# EAGLE schematic proto (EAGLE 5.10)
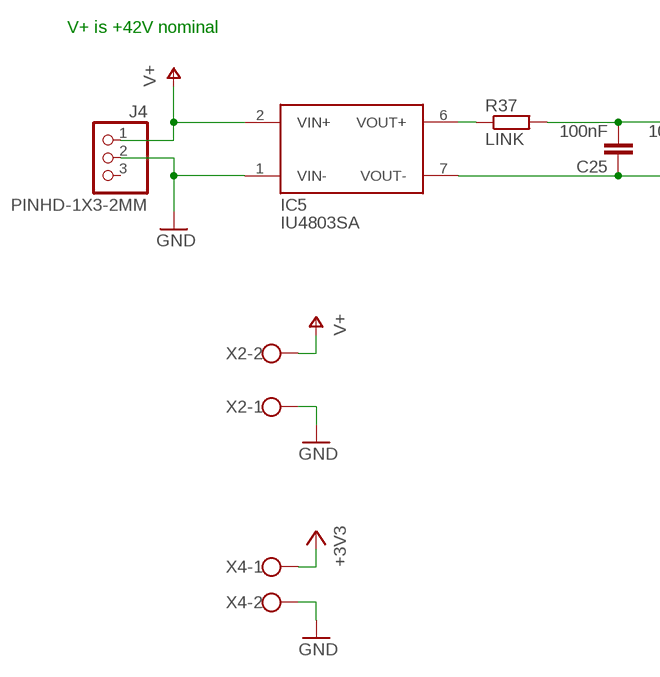
[diagram p0: schematic, sheet 1, part 1 of 2]
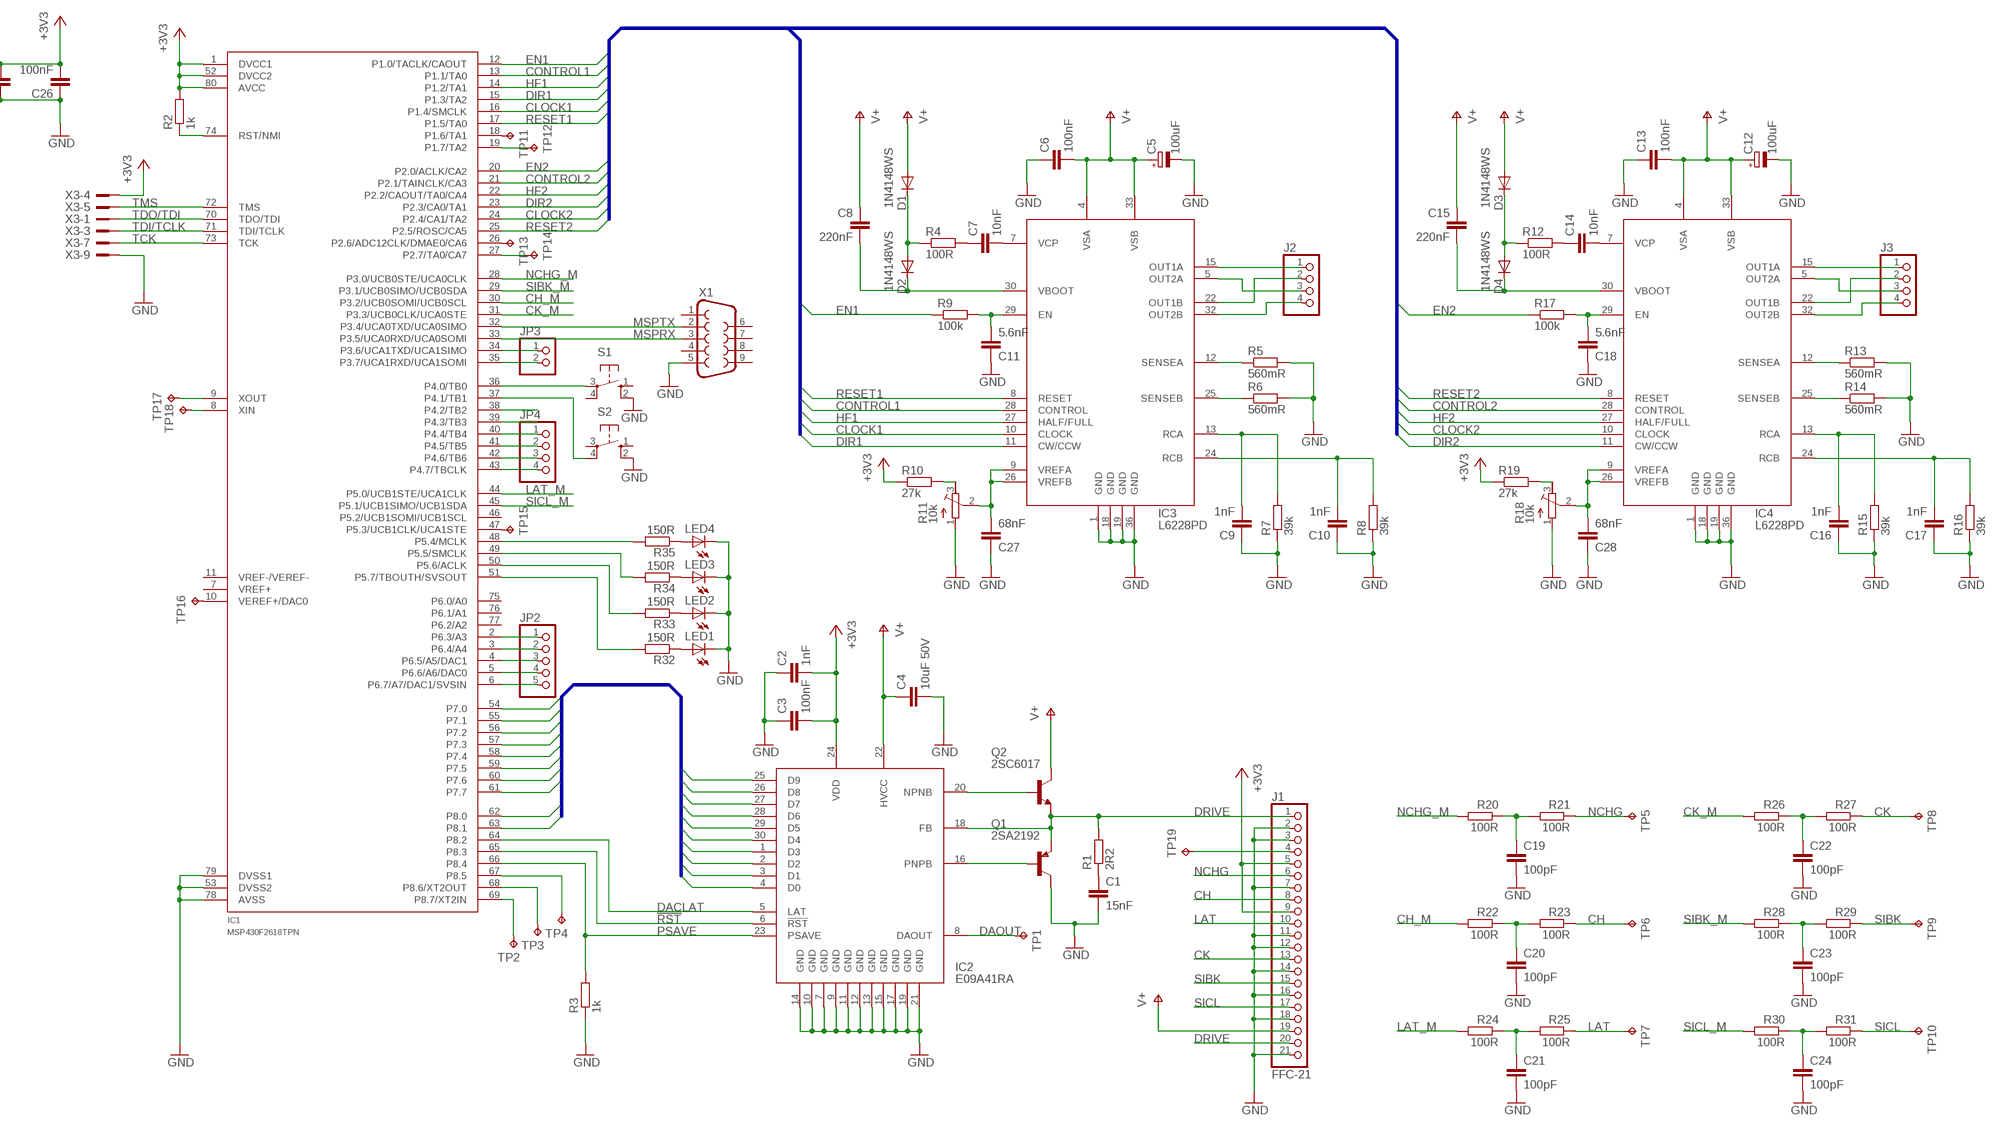
[diagram p1: schematic, sheet 1, part 2 of 2]

## Parts
C1  15nF  C-EUC0603  [C0603]
C2  1nF  C-EUC0603  [C0603]
C3  100nF  C-EUC0603  [C0603]
C4  10uF 50V  C-EUC1210  [C1210]
C5  100uF  CPOL-EUE3.5-8  [E3,5-8]
C6  100nF  C-EUC0805  [C0805]
C7  10nF  C-EUC0603  [C0603]
C8  220nF  C-EUC0603  [C0603]
C9  1nF  C-EUC0603  [C0603]
C10  1nF  C-EUC0603  [C0603]
C11  5.6nF  C-EUC0603  [C0603]
C12  100uF  CPOL-EUE3.5-8  [E3,5-8]
C13  100nF  C-EUC0805  [C0805]
C14  10nF  C-EUC0603  [C0603]
C15  220nF  C-EUC0603  [C0603]
C16  1nF  C-EUC0603  [C0603]
C17  1nF  C-EUC0603  [C0603]
C18  5.6nF  C-EUC0603  [C0603]
C19  100pF  C-EUC0603  [C0603]
C20  100pF  C-EUC0603  [C0603]
C21  100pF  C-EUC0603  [C0603]
C22  100pF  C-EUC0603  [C0603]
C23  100pF  C-EUC0603  [C0603]
C24  100pF  C-EUC0603  [C0603]
C25  100nF  C-EUC0603  [C0603]
C26  100nF  C-EUC0603  [C0603]
C27  68nF  C-EUC0603  [C0603]
C28  68nF  C-EUC0603  [C0603]
D1  1N4148WS  DIODE-SOD323-R  [SOD323-R]
D2  1N4148WS  DIODE-SOD323-R  [SOD323-R]
D3  1N4148WS  DIODE-SOD323-R  [SOD323-R]
D4  1N4148WS  DIODE-SOD323-R  [SOD323-R]
IC1  MSP430F2618TPN  MSP430261XTPN  [SQFP-S-12X12-80]
IC2  E09A41RA  [SOP30]
IC3  L6228PD  [POWERSO-36]
IC4  L6228PD  [POWERSO-36]
IC5  IU4803SA  [IU-SIP]
J1  FFC-21  [FFC-21]
J2  PINHD-1X4-2MM  [4-WAY-2MM]
J3  PINHD-1X4-2MM  [4-WAY-2MM]
J4  PINHD-1X3-2MM  [3-WAY-2MM]
JP2  PINHD-1X5  [1X05]
JP3  PINHD-1X2  [1X02]
JP4  PINHD-1X4  [1X04]
LED1  LEDCHIPLED_1206  [CHIPLED_1206]
LED2  LEDCHIPLED_1206  [CHIPLED_1206]
LED3  LEDCHIPLED_1206  [CHIPLED_1206]
LED4  LEDCHIPLED_1206  [CHIPLED_1206]
Q1  2SA2192  [DPACK_1]
Q2  2SC6017  [DPACK_1]
R1  2R2  R-EU_R0603  [R0603]
R2  1k  R-EU_R0603  [R0603]
R3  1k  R-EU_R0603  [R0603]
R4  100R  R-EU_R0603  [R0603]
R5  560mR  R-EU_R2512  [R2512]
R6  560mR  R-EU_R2512  [R2512]
R7  39k  R-EU_R0603  [R0603]
R8  39k  R-EU_R0603  [R0603]
R9  100k  R-EU_R0603  [R0603]
R10  27k  R-EU_R0603  [R0603]
R11  10k  R-TRIMMTSM53YJ  [RTRIMTSM53YJ]
R12  100R  R-EU_R0603  [R0603]
R13  560mR  R-EU_R2512  [R2512]
R14  560mR  R-EU_R2512  [R2512]
R15  39k  R-EU_R0603  [R0603]
R16  39k  R-EU_R0603  [R0603]
R17  100k  R-EU_R0603  [R0603]
R18  10k  R-TRIMMTSM53YJ  [RTRIMTSM53YJ]
R19  27k  R-EU_R0603  [R0603]
R20  100R  R-EU_R0603  [R0603]
R21  100R  R-EU_R0603  [R0603]
R22  100R  R-EU_R0603  [R0603]
R23  100R  R-EU_R0603  [R0603]
R24  100R  R-EU_R0603  [R0603]
R25  100R  R-EU_R0603  [R0603]
R26  100R  R-EU_R0603  [R0603]
R27  100R  R-EU_R0603  [R0603]
R28  100R  R-EU_R0603  [R0603]
R29  100R  R-EU_R0603  [R0603]
R30  100R  R-EU_R0603  [R0603]
R31  100R  R-EU_R0603  [R0603]
R32  150R  R-EU_R0603  [R0603]
R33  150R  R-EU_R0603  [R0603]
R34  150R  R-EU_R0603  [R0603]
R35  150R  R-EU_R0603  [R0603]
R37  LINK  R-EU_R2010  [R2010]
S1  10-XX  [B3F-10XX]
S2  10-XX  [B3F-10XX]
TP1  TPB1,27  [B1,27]
TP2  TPB1,27  [B1,27]
TP3  TPB1,27  [B1,27]
TP4  TPB1,27  [B1,27]
TP5  TPB1,27  [B1,27]
TP6  TPB1,27  [B1,27]
TP7  TPB1,27  [B1,27]
TP8  TPB1,27  [B1,27]
TP9  TPB1,27  [B1,27]
TP10  TPB1,27  [B1,27]
TP11  TPB1,27  [B1,27]
TP12  TPB1,27  [B1,27]
TP13  TPB1,27  [B1,27]
TP14  TPB1,27  [B1,27]
TP15  TPB1,27  [B1,27]
TP16  TPB1,27  [B1,27]
TP17  TPB1,27  [B1,27]
TP18  TPB1,27  [B1,27]
TP19  TPB1,27  [B1,27]
X1  F09HP  [F09HP]
X2  W237-102  [W237-102]
X3  2514-  [PAK100/2500-14]
X4  W237-102  [W237-102]

## Nets
!RST: IC1.65(P8.3) IC2.6(!RST)
+3V3: C2.2 C3.2 C25.2 C26.2 IC1.1(DVCC1) IC1.52(DVCC2) IC1.80(AVCC) IC2.24(VDD) J1.5 J1.9 R2.2 R10.1 R19.1 R37.2 X3.4 X4.1
CH: J1.8 R23.1 TP6.TP
CH_M: IC1.30(P3.2/UCB0SOMI/UCB0SCL) R22.2
CK: J1.13 R27.1 TP8.TP
CK_M: IC1.31(P3.3/UCB0CLK/UCA0STE) R26.2
CLOCK1: IC1.16(P1.4/SMCLK) IC3.10(CLOCK)
CLOCK2: IC1.24(P2.4/CA1/TA2) IC4.10(CLOCK)
CONTROL1: IC1.13(P1.1/TA0) IC3.28(CONTROL)
CONTROL2: IC1.21(P2.1/TAINCLK/CA3) IC4.28(CONTROL)
D0: IC1.54(P7.0) IC2.4(D0)
D1: IC1.55(P7.1) IC2.3(D1)
D2: IC1.56(P7.2) IC2.2(D2)
D3: IC1.57(P7.3) IC2.1(D3)
D4: IC1.58(P7.4) IC2.30(D4)
D5: IC1.59(P7.5) IC2.29(D5)
D6: IC1.60(P7.6) IC2.28(D6)
D7: IC1.61(P7.7) IC2.27(D7)
D8: IC1.62(P8.0) IC2.26(D8)
D9: IC1.63(P8.1) IC2.25(D9)
DACLAT: IC1.64(P8.2) IC2.5(LAT)
DAOUT: IC2.8(DAOUT) TP1.TP
DIR1: IC1.15(P1.3/TA2) IC3.11(CW/CCW)
DIR2: IC1.23(P2.3/CA0/TA1) IC4.11(CW/CCW)
DRIVE: IC2.18(FB) J1.1 J1.20 Q1.E Q2.E R1.2
EN1: IC1.12(P1.0/TACLK/CAOUT) R9.1
EN2: IC1.20(P2.0/ACLK/CA2) R17.1
GND: C1.2 C2.1 C3.1 C4.2 C5.- C6.1 C9.1 C10.1 C11.1 C12.- C13.1 C16.1 C17.1 C18.1 C19.2 C20.2 C21.2 C22.2 C23.2 C24.2 C25.1 C26.1 C27.1 C28.1 IC1.53(DVSS2) IC1.78(AVSS) IC1.79(DVSS1) IC2.7(GND) IC2.9(GND) IC2.10(GND) IC2.11(GND) IC2.12(GND) IC2.13(GND) IC2.14(GND) IC2.15(GND) IC2.17(GND) IC2.19(GND) IC2.21(GND) IC3.1(GND) IC3.18(GND) IC3.19(GND) IC3.36(GND) IC4.1(GND) IC4.18(GND) IC4.19(GND) IC4.36(GND) IC5.1(VIN-) IC5.7(VOUT-) J1.2 J1.3 J1.7 J1.11 J1.12 J1.14 J1.16 J1.18 J1.21 J4.2 LED1.C LED2.C LED3.C LED4.C Q1.C R3.1 R5.2 R6.2 R7.1 R8.1 R11.1(E) R13.2 R14.2 R15.1 R16.1 R18.1(E) S1.2(S1) S2.2(S1) X1.5 X2.1 X3.9 X4.2
HF1: IC1.14(P1.2/TA1) IC3.27(HALF/FULL)
HF2: IC1.22(P2.2/CAOUT/TA0/CA4) IC4.27(HALF/FULL)
LAT: J1.10 R25.1 TP7.TP
LAT_M: IC1.44(P5.0/UCB1STE/UCA1CLK) R24.2
MSPRX: IC1.33(P3.5/UCA0RXD/UCA0SOMI) X1.3
MSPTX: IC1.32(P3.4/UCA0TXD/UCA0SIMO) X1.2
N$1: IC2.20(NPNB) Q2.B
N$2: IC1.67(P8.5) TP4.TP
N$3: IC2.16(PNPB) Q1.B
N$4: C1.1 R1.1
N$5: IC1.68(P8.6/XT2OUT) TP3.TP
N$6: IC1.69(P8.7/XT2IN) TP2.TP
N$7: C8.2 D2.C IC3.30(VBOOT)
N$8: IC1.74(RST/NMI) R2.1
N$9: C7.2 IC3.7(VCP)
N$10: C10.2 IC3.24(RCB) R8.2
N$11: C7.1 R4.2
N$12: D1.C D2.A R4.1
N$13: R10.2 R11.3(A)
N$14: C9.2 IC3.13(RCA) R7.2
N$15: IC3.12(SENSEA) R5.1
N$16: IC3.25(SENSEB) R6.1
N$17: C11.2 IC3.29(EN) R9.2
N$18: C27.2 IC3.9(VREFA) IC3.26(VREFB) R11.2(S)
N$19: IC1.18(P1.6/TA1) TP11.TP
N$20: C14.2 IC4.7(VCP)
N$21: C14.1 R12.2
N$22: D3.C D4.A R12.1
N$23: IC4.12(SENSEA) R13.1
N$24: IC4.25(SENSEB) R14.1
N$25: C17.2 IC4.24(RCB) R16.2
N$26: C16.2 IC4.13(RCA) R15.2
N$27: C15.2 D4.C IC4.30(VBOOT)
N$28: C18.2 IC4.29(EN) R17.2
N$29: R18.3(A) R19.2
N$30: C28.2 IC4.9(VREFA) IC4.26(VREFB) R18.2(S)
N$31: IC1.19(P1.7/TA2) TP12.TP
N$32: C19.1 R20.1 R21.2
N$33: C20.1 R22.1 R23.2
N$34: C21.1 R24.1 R25.2
N$35: C22.1 R26.1 R27.2
N$36: C23.1 R28.1 R29.2
N$37: C24.1 R30.1 R31.2
N$38: IC1.27(P2.7/TA0/CA7) TP14.TP
N$39: IC1.26(P2.6/ADC12CLK/DMAE0/CA6) TP13.TP
N$40: LED1.A R32.1
N$41: LED2.A R33.1
N$42: LED3.A R34.1
N$43: LED4.A R35.1
N$44: IC1.51(P5.7/TBOUTH/SVSOUT) R32.2
N$45: IC1.50(P5.6/ACLK) R33.2
N$46: IC1.49(P5.5/SMCLK) R34.2
N$47: IC1.48(P5.4/MCLK) R35.2
N$48: IC1.36(P4.0/TB0) S1.3(P)
N$49: IC1.37(P4.1/TB1) S2.4(P1)
N$50: J1.4 TP19.TP
N$53: IC1.2(P6.3/A3) JP2.1
N$54: IC1.3(P6.4/A4) JP2.2
N$55: IC1.4(P6.5/A5/DAC1) JP2.3
N$56: IC1.5(P6.6/A6/DAC0) JP2.4
N$57: IC1.6(P6.7/A7/DAC1/SVSIN) JP2.5
N$58: IC1.38(P4.2/TB2)
N$59: IC1.39(P4.3/TB3)
N$60: IC1.40(P4.4/TB4) JP4.1
N$61: IC1.41(P4.5/TB5) JP4.2
N$62: IC1.42(P4.6/TB6) JP4.3
N$63: IC1.43(P4.7/TBCLK) JP4.4
N$64: IC1.47(P5.3/UCB1CLK/UCA1STE) TP15.TP
N$65: IC1.34(P3.6/UCA1TXD/UCA1SIMO) JP3.1
N$66: IC1.35(P3.7/UCA1RXD/UCA1SOMI) JP3.2
N$67: IC3.15(OUT1A) J2.1
N$68: IC3.5(OUT2A) J2.3
N$69: IC3.22(OUT1B) J2.2
N$70: IC3.32(OUT2B) J2.4
N$71: IC4.5(OUT2A) J3.3
N$72: IC4.22(OUT1B) J3.2
N$73: IC4.32(OUT2B) J3.4
N$74: IC4.15(OUT1A) J3.1
N$75: IC1.10(VEREF+/DAC0) TP16.TP
N$76: IC1.9(XOUT) TP17.TP
N$77: IC1.8(XIN) TP18.TP
NCHG: J1.6 R21.1 TP5.TP
NCHG_M: IC1.28(P3.0/UCB0STE/UCA0CLK) R20.2
PSAVE: IC1.66(P8.4) IC2.23(PSAVE) R3.2
RESET1: IC1.17(P1.5/TA0) IC3.8(RESET)
RESET2: IC1.25(P2.5/ROSC/CA5) IC4.8(RESET)
SIBK: J1.15 R29.1 TP9.TP
SIBK_M: IC1.29(P3.1/UCB0SIMO/UCB0SDA) R28.2
SICL: J1.17 R31.1 TP10.TP
SICL_M: IC1.45(P5.1/UCB1SIMO/UCB1SDA) R30.2
TCK: IC1.73(TCK) X3.7
TDI/TCLK: IC1.71(TDI/TCLK) X3.3
TDO/TDI: IC1.70(TDO/TDI) X3.1
TMS: IC1.72(TMS) X3.5
V+: C4.1 C5.+ C6.2 C8.1 C12.+ C13.2 C15.1 D1.A D3.A IC2.22(HVCC) IC3.4(VSA) IC3.33(VSB) IC4.4(VSA) IC4.33(VSB) IC5.2(VIN+) J1.19 J4.1 Q2.C X2.2
VOUT+: IC5.6(VOUT+) R37.1
Unconnected: IC1.7(VREF+) IC1.11(VREF-/VEREF-) IC1.46(P5.2/UCB1SOMI/UCB1SCL) IC1.75(P6.0/A0) IC1.76(P6.1/A1) IC1.77(P6.2/A2) J4.3 S1.1(S) S1.4(P1) S2.1(S) S2.3(P) X1.1 X1.4 X1.6 X1.7 X1.8 X1.9 X3.2 X3.6 X3.8 X3.10 X3.11 X3.12 X3.13 X3.14

## Buses
D[0..9]
STEPPER:EN1,RESET1,CONTROL1,HF1,CLOCK1,DIR1,EN2,RESET2,CONTROL2,HF2,CLOCK2,DIR2

## Notes on the sheet
- V+ is +42V nominal

## Library data of the parts
C1-C4 C6-C11 C13-C28 = rcl:C-EU: CAPACITOR, European symbol
C5 C12 = rcl:CPOL-EU: POLARIZED CAPACITOR, European symbol
D1-D4 = diode:DIODE-: DIODE
IC1 = parts:MSP430261XTPN
IC2 = crayon:E09A41RA
IC3 IC4 = crayon:L6228
IC5 = crayon:IU4803SA
J1 = crayon:FFC-21
J2 J3 = crayon:PINHD-1X4-2MM: PIN HEADER
J4 = crayon:PINHD-1X3-2MM
JP2 = pinhead:PINHD-1X5: PIN HEADER
JP3 = pinhead:PINHD-1X2: PIN HEADER
JP4 = pinhead:PINHD-1X4: PIN HEADER
LED1-LED4 = led:LED: LED OSRAM: - CHIPLED LG R971, LG N971, LY N971, LG Q971, LY Q971, LO R971, LY R971 LH N974, LH R974 LS Q976, LO Q976, LY Q976 LO Q996 - Hyper CHIPLED LW Q18S LB Q993, LB Q99A, LB R99A - SideLED LS A670, LO A670, LY A670, LG A670, LP A670 LB A673, LV A673, LT A673, LW A673 LH A674 LY A675 LS A676, LA A676, LO A676, LY A676, LW A676 LS A679, LY A679, LG A679 - Hyper Micro SIDELED® LS Y876, LA Y876, LO Y876, LY Y876 LT Y87S - SmartLED LW L88C, LW L88S LB L89C, LB L89S, LG L890 LS L89K, LO L89K, LY L89K LS L896, LA L896, LO L896, LY L896 - TOPLED LS T670, LO T670, LY T670, LG T670, LP T670 LSG T670, LSP T670, LSY T670, LOP T670, LYG T670 LG T671, LOG T671, LSG T671 LB T673, LV T673, LT T673, LW T673 LH T674 LS T676, LA T676, LO T676, LY T676, LB T676, LH T676, LSB T676, LW T676 LB T67C, LV T67C, LT T67C, LS T67K, LO T67K, LY T67K, LW E67C LS E67B, LA E67B, LO E67B, LY E67B, LB E67C, LV E67C, LT E67C LW T67C LS T679, LY T679, LG T679 LS T770, LO T770, LY T770, LG T770, LP T770 LB T773, LV T773, LT T773, LW T773 LH T774 LS E675, LA E675, LY E675, LS T675 LS T776, LA T776, LO T776, LY T776, LB T776 LHGB T686 LT T68C, LB T68C - Hyper Mini TOPLED® LB M676 - Mini TOPLED Santana® LG M470 LS M47K, LO M47K, LY M47K Source: http://www.osram.convergy.de LUXEON: - LUMILED® LXK2-PW12-R00, LXK2-PW12-S00, LXK2-PW14-U00, LXK2-PW14-V00 LXK2-PM12-R00, LXK2-PM12-S00, LXK2-PM14-U00 LXK2-PE12-Q00, LXK2-PE12-R00, LXK2-PE12-S00, LXK2-PE14-T00, LXK2-PE14-U00 LXK2-PB12-K00, LXK2-PB12-L00, LXK2-PB12-M00, LXK2-PB14-N00, LXK2-PB14-P00, LXK2-PB14-Q00 LXK2-PR12-L00, LXK2-PR12-M00, LXK2-PR14-Q00, LXK2-PR14-R00 LXK2-PD12-Q00, LXK2-PD12-R00, LXK2-PD12-S00 LXK2-PH12-R00, LXK2-PH12-S00 LXK2-PL12-P00, LXK2-PL12-Q00, LXK2-PL12-R00 Source: www.luxeon.com KINGBRIGHT: KA-3528ASYC Source: www.kingbright.com
Q1 = crayon:2SA2192
Q2 = crayon:2SC6017
R1-R10 R12-R17 R19-R35 R37 = rcl:R-EU_: RESISTOR, European symbol
R11 R18 = rcl:R-TRIMM: Trimm resistor
S1 S2 = switch-omron:10-XX: OMRON SWITCH
TP1-TP19 = testpad:TP: Test pad
X1 = con-subd:F09: SUB-D
X2 X4 = con-wago-500:W237-102: WAGO SCREW CLAMP
X3 = con-3m:2514-: 3M (TM) Pak 100 4-Wall Header Source: 3M